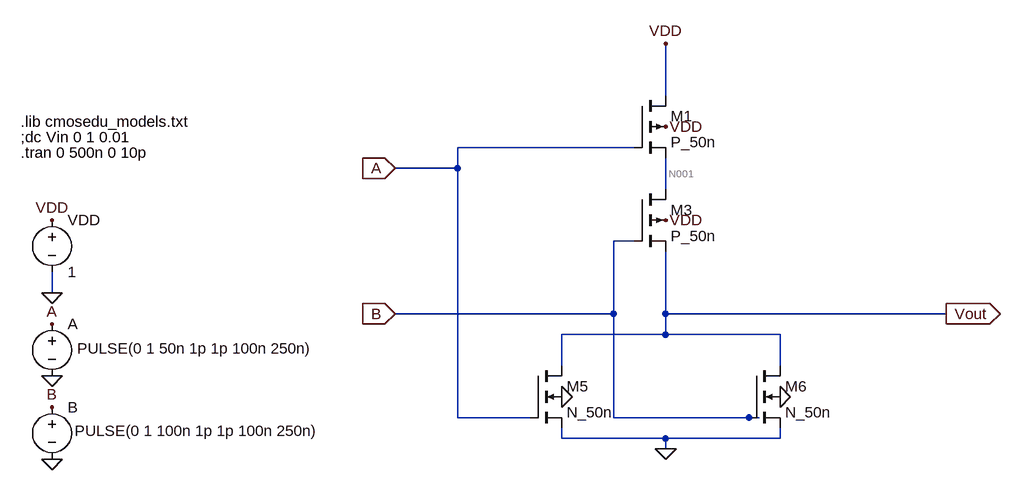
[diagram p0: schematic NOR.asc]
NOR.asc, the LTspice schematic file:
Version 4
SHEET 1 880 680
WIRE 64 -480 64 -560
WIRE 16 -400 -256 -400
WIRE -256 -368 -256 -400
WIRE -256 -368 -352 -368
WIRE 64 -336 64 -384
WIRE 16 -256 -16 -256
WIRE -880 -176 -880 -208
WIRE -16 -144 -16 -256
WIRE -16 -144 -352 -144
WIRE 64 -144 64 -240
WIRE 496 -144 64 -144
WIRE 64 -112 64 -144
WIRE 64 -112 -96 -112
WIRE 240 -112 64 -112
WIRE -96 -64 -96 -112
WIRE 240 -64 240 -112
WIRE -256 16 -256 -368
WIRE -144 16 -256 16
WIRE -16 16 -16 -144
WIRE 192 16 -16 16
WIRE 208 16 192 16
WIRE -96 48 -96 32
WIRE 64 48 -96 48
WIRE 240 48 240 32
WIRE 240 48 64 48
WIRE 64 64 64 48
FLAG -880 -176 0
FLAG -880 -288 VDD
FLAG -880 -128 A
FLAG -880 0 B
FLAG -880 -48 0
FLAG -880 80 0
FLAG 240 -16 0
FLAG -96 -16 0
FLAG 64 -432 VDD
FLAG -352 -368 A
IOPIN -352 -368 In
FLAG -352 -144 B
IOPIN -352 -144 In
FLAG 496 -144 Vout
IOPIN 496 -144 Out
FLAG 64 -560 VDD
FLAG 64 64 0
FLAG 64 -288 VDD
SYMBOL voltage -880 -304 R0
SYMATTR InstName VDD
SYMATTR Value 1
SYMBOL voltage -880 -144 R0
WINDOW 3 39 53 Left 2
WINDOW 123 0 0 Left 0
WINDOW 39 0 0 Left 0
SYMATTR Value PULSE(0 1 50n 1p 1p 100n 250n)
SYMATTR InstName A
SYMBOL voltage -880 -16 R0
WINDOW 123 0 0 Left 0
WINDOW 39 0 0 Left 0
WINDOW 3 35 52 Left 2
SYMATTR Value PULSE(0 1 100n 1p 1p 100n 250n)
SYMATTR InstName B
SYMBOL pmos4 16 -480 R0
SYMATTR InstName M1
SYMATTR Value P_50n
SYMATTR Value2 l=50n w=0.8u
SYMBOL pmos4 16 -336 R0
SYMATTR InstName M3
SYMATTR Value P_50n
SYMATTR Value2 l=50n w=0.8u
SYMBOL nmos4 -144 -64 R0
SYMATTR InstName M5
SYMATTR Value N_50n
SYMATTR Value2 l=50n w=0.2u
SYMBOL nmos4 192 -64 R0
SYMATTR InstName M6
SYMATTR Value N_50n
SYMATTR Value2 l=50n w=0.2u
TEXT -928 -416 Left 2 !;dc Vin 0 1 0.01
TEXT -928 -440 Left 2 !.lib cmosedu_models.txt
TEXT -928 -392 Left 2 !.tran 0 500n 0 10p

The netlist it stands for:
* NOR.asc
VDD VDD 0 1
V§A A 0 PULSE(0 1 50n 1p 1p 100n 250n)
V§B B 0 PULSE(0 1 100n 1p 1p 100n 250n)
M1 VDD A N001 VDD P_50n l=50n w=0.8u
M3 N001 B Vout VDD P_50n l=50n w=0.8u
M5 Vout A 0 0 N_50n l=50n w=0.2u
M6 Vout B 0 0 N_50n l=50n w=0.2u
.model NMOS NMOS
.model PMOS PMOS
.lib standard.mos
;dc Vin 0 1 0.01
.lib cmosedu_models.txt
.tran 0 500n 0 10p
.backanno
.end

* Results of the author's LTspice run, read from the files saved beside the schematic
* Operating Point, zero values left out:
*   V(vdd) = 1 V
*   V(n001) = 1 V
*   V(vout) = 999.9 mV
*   Id(M6) = 1.413 nA
*   Ig(M6) = -240.7 pA
*   Ib(M6) = -1 pA
*   Is(M6) = -1.171 nA
*   Id(M5) = 1.413 nA
*   Ig(M5) = -240.7 pA
*   Ib(M5) = -1 pA
*   Is(M5) = -1.171 nA
*   Id(M3) = 16.73 nA
*   Ig(M3) = -14.02 nA
*   Ib(M3) = 111.1 pA
*   Is(M3) = -2.825 nA
*   Id(M1) = 30.64 nA
*   Ig(M1) = -14.02 nA
*   Ib(M1) = 111.2 pA
*   Is(M1) = -16.73 nA
*   I(B) = 14.26 nA
*   I(A) = 14.26 nA
*   I(Vdd) = -30.86 nA
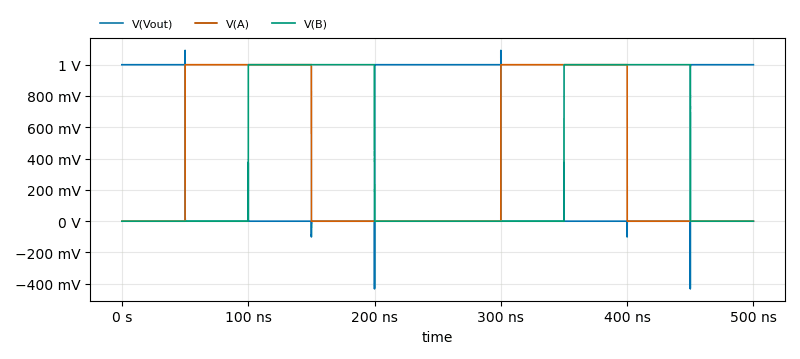
[diagram p1: Transient Analysis of NOR.asc, plotted from the saved traces]
* Transient Analysis, 1 run:
*   V(Vout): min -432.1 mV, max 1.092 V, average 400 mV, rms 632.4 mV, last 999.9 mV
*   V(A): min 0 V, max 1 V, average 400 mV, rms 632.5 mV, last 0 V
*   V(B): min 0 V, max 1 V, average 400 mV, rms 632.5 mV, last 0 V